# EAGLE board V0 (EAGLE 9.3.0)
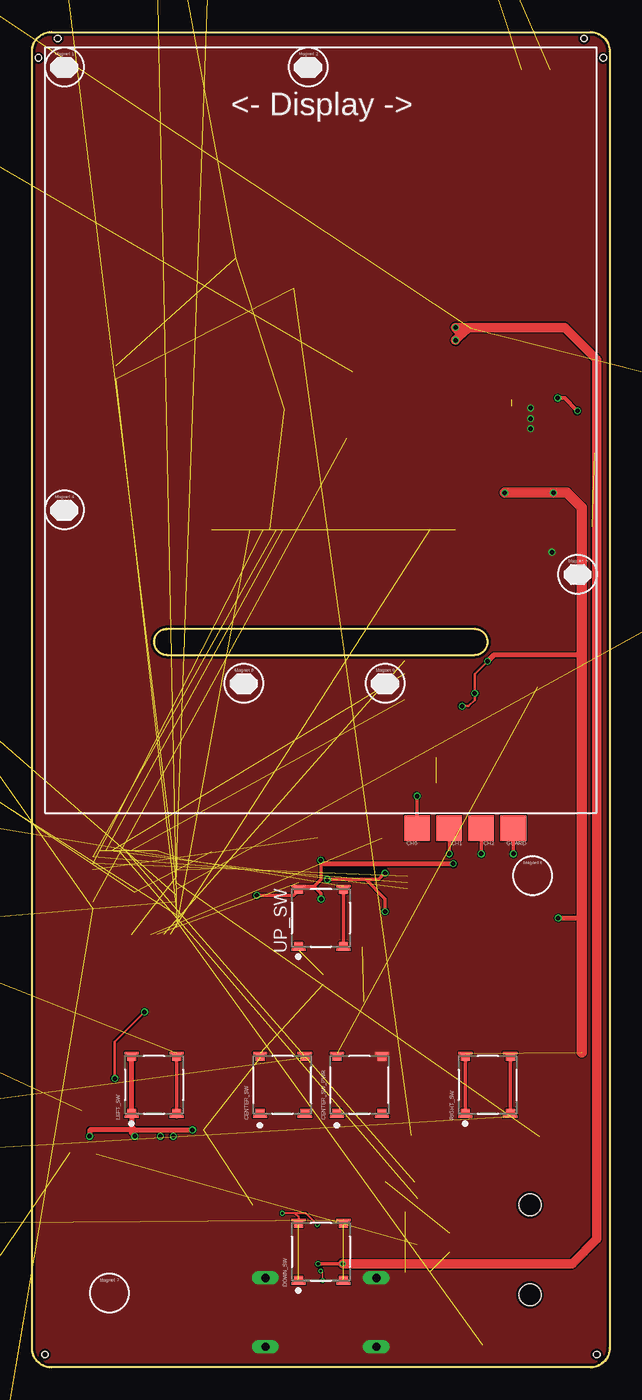
[diagram p10: board, top side]
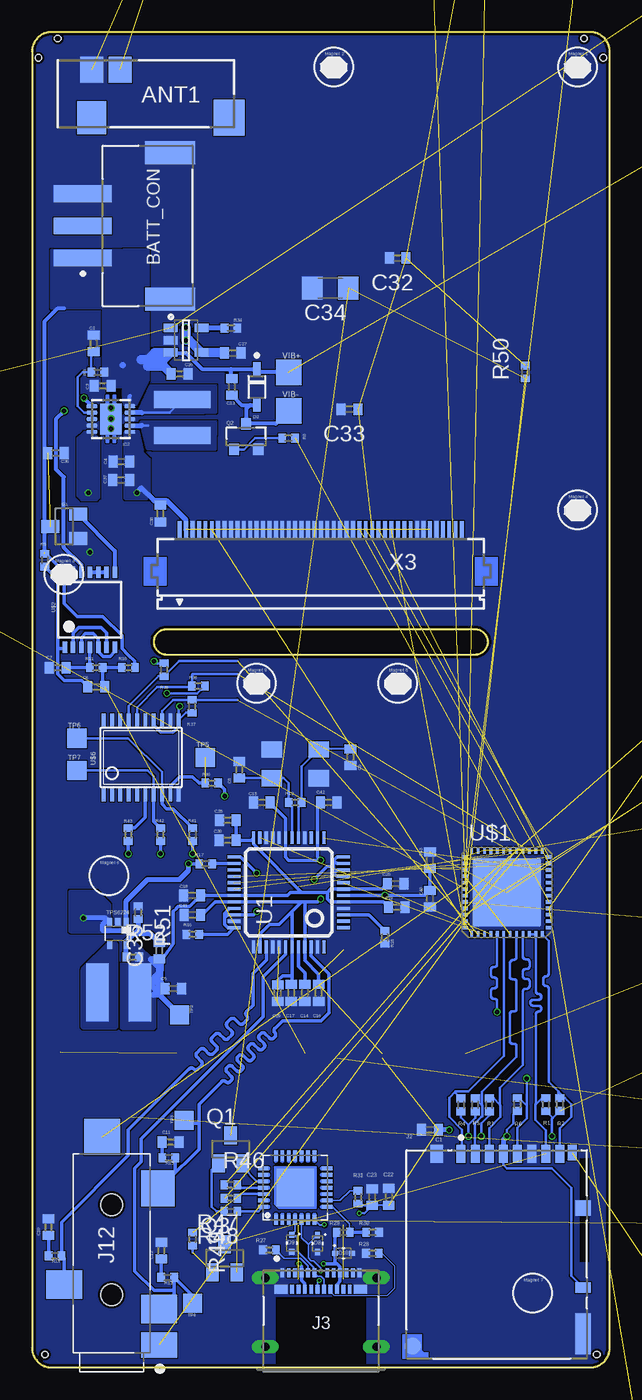
[diagram p11: board, bottom side, seen from below]

Size 45 x 104 mm. Coordinates in mm from the lower left corner, seen from the top.
Outline: 43.5,104 arc-90 45,102.5 45,1.5 arc-90 43.5,0 1.5,0 arc-90 0,1.5 0,102.5 arc-90 1.5,104 43.5,104
Outline: 10.5,55.5 34.5,55.5 arc90 35.5,56.5 arc90 34.5,57.5 10.5,57.5 arc90 9.5,56.5 arc90 10.5,55.5
Copper layers (1*16): Top 0.035mm / dielectric 1.5mm / Bottom 0.035mm
Design rules "jlcpcb": minimum track width 3.5mil, minimum drill 0.2mm, track to track 3.5mil, track to pad 3.5mil, pad to pad 6mil, via to via 6mil, smd to smd 6mil, copper to edge 0.2mm, drill to drill 0.2mm, minimum pad ring 3mil, minimum via ring 3mil, stop-mask expansion 4mil, vias tented up to drill 0mil, thermal gap 10mil
Holes 0.5 mm at 44,1 1,1 0.5,102 44.5,102 2,103.5 43,103.5

## Footprints (pad centres in the part's own frame; a part is rotated, then mirrored left to right if it is on the bottom)
PRO-OB-440_1 = smd 2 x 1.8: 1 1.865,-2.65; 2 1.865,-4.85 | smd 2.6 x 2.25: 3 -1.865,-2.65 | smd 2.8 x 2.45: 4 -1.865,-13.35
JST_S3B-XH-SM4-TB_0 = smd 1.3 x 4.5: 1 -2.5,5.05; 2 0,5.05; 3 2.5,5.05 | smd 1.8 x 3.9: 4 -5.7,-1.75; 5 5.7,-1.75
C0402 = smd 0.7 x 0.9: 1 -0.65,0; 2 0.65,0
C/6032-28R = smd 2.55 x 2.5: + 2.525,0; - -2.525,0
C0201 = smd 0.25 x 0.35: 1 -0.25,0; 2 0.25,0
C1206 = smd 1.6 x 1.8: 1 -1.4,0; 2 1.4,0
E-SWITCH_TL3315NF100Q_0 = smd 0.5 x 0.7: 1 -2.125,1.75; 2 2.125,1.75; 3 -2.125,-1.75; 4 2.125,-1.75 | smd 0.2 x 1.1: 1-2 -2.475,1.75; 2-2 2.475,1.75; 3-2 -2.475,-1.75; 4-2 2.475,-1.75
TP20SQ = smd 2 x 2: TP 0,0
BROADCOM_HSMF-C113_0 = smd 0.85 x 0.9: 1 -1.325,-0.25; 4 1.325,-0.25 | smd 0.45 x 0.5: 2 -0.425,-0.6; 3 0.425,-0.6
ON_SEMI_1N914BWS_0 = smd 1.05 x 0.55: 1 -1.4,0; 2 1.4,0
SOD-523 = smd 0.8 x 0.6: A 0,-0.8; K 0,0.8
ON_SEMICONDUCTOR_ESD5Z5.0T1G_0 = smd 0.48 x 0.4: 1 -0.66,0; 2 0.66,0
E-SWITCH_TL3315NF160Q_0 = smd 0.5 x 0.7: 1 -2.125,1.75; 2 2.125,1.75; 3 -2.125,-1.75; 4 2.125,-1.75 | smd 0.2 x 1.1: 1-2 -2.475,1.75; 2-2 2.475,1.75; 3-2 -2.475,-1.75; 4-2 2.475,-1.75
SOT23 = smd 1 x 1.4: 1 -0.95,-1.1; 2 0.95,-1.1; 3 0,1.1
DRC-S-PVSON-N10 = smd 0.28 x 0.85: 1 -1,-1.475; 2 -0.5,-1.475; 3 0,-1.475; 4 0.5,-1.475; 5 1,-1.475; 6 1,1.475; 7 0.5,1.475; 8 0,1.475; 9 -0.5,1.475; 10 -1,1.475 | smd 2.4 x 1.65: TH 0,0
HIROSE_DM3BT-DSF-PEJS_0 = smd 0.7 x 1.4: 1 -2.775,7.825; 2 -1.675,7.825; 3 -0.575,7.825; 4 0.525,7.825; 5 1.625,7.825; 6 2.725,7.825; 7 3.825,7.825; 8 4.925,7.825 | smd 0.7 x 1.2: 9 5.875,7.925 | smd 1.2 x 0.8: 10 6.725,-2.575 | smd 1 x 1.4: 11 -4.675,7.825 | smd 1.2 x 1.2: 12 6.725,3.625 | smd 1.311 x 1.311: 13 -6.553,-7.116 | smd 1.2 x 3.2: 14 6.725,-6.175
MOLEX_105450-0101_0 = drill 0.635 pad 1.067 long: 1 -4.32,3.36; 2 4.32,3.36; 3 -4.32,-2; 4 4.32,-2 | smd 0.3 x 0.7: A1 -3,3.77; A2 -2.5,3.77; A3 -2,3.77; A4 -1.5,3.77; A5 -1,3.77; A6 -0.5,3.77; A7 0.5,3.77; A8 1,3.77; A9 1.5,3.77; A10 2,3.77; A11 2.5,3.77; A12 3,3.77; B2 2.25,2.47; B3 1.75,2.47; B4 1.25,2.47; B5 0.75,2.47; B6 0.25,2.47; B7 -0.25,2.47; B8 -0.75,2.47; B9 -1.25,2.47; B10 -1.75,2.47; B11 -2.25,2.47 | smd 1 x 0.7: B1 3.1,2.47; B12 -3.1,2.47
CUI_SJ-43515TS-SMT = smd 2 x 2.8: 1 -7.15,-3.7 | smd 2.8 x 2.6: 2 5.05,-3.6 | smd 2.2 x 2.8: 3 -2.45,3.7; 4 -4.35,-3.7 | smd 2.8 x 2.8: 5 9.05,0.75 | hole 1.7: -3.25,0; 3.75,0
QFN28 = smd 2.9 x 2.9: P$0 0,0 | smd 0.8 x 0.3: P$1 -2.5,1.5; P$2 -2.5,1; P$3 -2.5,0.5; P$4 -2.5,0; P$5 -2.5,-0.5; P$6 -2.5,-1; P$7 -2.5,-1.5; P$15 2.5,-1.5; P$16 2.5,-1; P$17 2.5,-0.5; P$18 2.5,0; P$19 2.5,0.5; P$20 2.5,1; P$21 2.5,1.5 | smd 0.3 x 0.8: P$8 -1.5,-2.5; P$9 -1,-2.5; P$10 -0.5,-2.5; P$11 0,-2.5; P$12 0.5,-2.5; P$13 1,-2.5; P$14 1.5,-2.5; P$22 1.5,2.5; P$23 1,2.5; P$24 0.5,2.5; P$25 0,2.5; P$26 -0.5,2.5; P$27 -1,2.5; P$31 -1.5,2.5
ON_SEMI_MMBT5551LT1G_0 = smd 0.9 x 0.8: 1 -1,0.95; 2 -1,-0.95; 3 1,0
R0402 = smd 0.6 x 0.7: 1 -0.5,0; 2 0.5,0
TP15SQ = smd 1.5 x 1.5: TP 0,0
TSP62240 = smd 0.4 x 0.7: 1 -0.65,-0.85; 2 0,-0.85; 3 0.65,-0.85; 4 0.65,0.85; 5 -0.65,0.85
LQFP48 = smd 0.25 x 1: 1 -2.75,-4.25; 2 -2.25,-4.25; 3 -1.75,-4.25; 4 -1.25,-4.25; 5 -0.75,-4.25; 6 -0.25,-4.25; 7 0.25,-4.25; 8 0.75,-4.25; 9 1.25,-4.25; 10 1.75,-4.25; 11 2.25,-4.25; 12 2.75,-4.25; 25 2.75,4.25; 26 2.25,4.25; 27 1.75,4.25; 28 1.25,4.25; 29 0.75,4.25; 30 0.25,4.25; 31 -0.25,4.25; 32 -0.75,4.25; 33 -1.25,4.25; 34 -1.75,4.25; 35 -2.25,4.25; 36 -2.75,4.25 | smd 1 x 0.25: 13 4.25,-2.75; 14 4.25,-2.25; 15 4.25,-1.75; 16 4.25,-1.25; 17 4.25,-0.75; 18 4.25,-0.25; 19 4.25,0.25; 20 4.25,0.75; 21 4.25,1.25; 22 4.25,1.75; 23 4.25,2.25; 24 4.25,2.75; 37 -4.25,2.75; 38 -4.25,2.25; 39 -4.25,1.75; 40 -4.25,1.25; 41 -4.25,0.75; 42 -4.25,0.25; 43 -4.25,-0.25; 44 -4.25,-0.75; 45 -4.25,-1.25; 46 -4.25,-1.75; 47 -4.25,-2.25; 48 -4.25,-2.75
MICROCHIP_MCP73831T-2ATI-OT_1 = smd 1.1 x 0.65: 1 -1.2,0.95; 2 -1.2,0; 3 -1.2,-0.95; 4 1.2,-0.95; 5 1.2,0.95
QFN48 = smd 0.55 x 0.3: 1 -3.275,2.75; 2 -3.275,2.25; 3 -3.275,1.75; 4 -3.275,1.25; 5 -3.275,0.75; 6 -3.275,0.25; 7 -3.275,-0.25; 8 -3.275,-0.75; 9 -3.275,-1.25; 10 -3.275,-1.75; 11 -3.275,-2.25; 12 -3.275,-2.75; 25 3.275,-2.75; 26 3.275,-2.25; 27 3.275,-1.75; 28 3.275,-1.25; 29 3.275,-0.75; 30 3.275,-0.25; 31 3.275,0.25; 32 3.275,0.75; 33 3.275,1.25; 34 3.275,1.75; 35 3.275,2.25; 36 3.275,2.75 | smd 0.3 x 0.55: 13 -2.75,-3.275; 14 -2.25,-3.275; 15 -1.75,-3.275; 16 -1.25,-3.275; 17 -0.75,-3.275; 18 -0.25,-3.275; 19 0.25,-3.275; 20 0.75,-3.275; 21 1.25,-3.275; 22 1.75,-3.275; 23 2.25,-3.275; 24 2.75,-3.275; 37 2.75,3.275; 38 2.25,3.275; 39 1.75,3.275; 40 1.25,3.275; 41 0.75,3.275; 42 0.25,3.275; 43 -0.25,3.275; 44 -0.75,3.275; 45 -1.25,3.275; 46 -1.75,3.275; 47 -2.25,3.275; 48 -2.75,3.275 | smd 5.309 x 5.309: EXP 0,0
TSSOP14 = smd 0.35 x 0.9: 1 -1.95,-2.925; 2 -1.3,-2.925; 3 -0.65,-2.925; 4 0,-2.925; 5 0.65,-2.925; 6 1.3,-2.925; 7 1.95,-2.925; 8 1.95,2.925; 9 1.3,2.925; 10 0.65,2.925; 11 0,2.925; 12 -0.65,2.925; 13 -1.3,2.925; 14 -1.95,2.925
INDUCTOR = smd 1.3 x 4.4: P$1 -1.5,0.2; P$2 1.3,0.2
ECSCRYSTAL = smd 1.6 x 1.25: GND -1.83,1.12; GND2 1.84,-1.11; IN/OUT 1.82,1.12; IN/OUT2 -1.83,-1.11
INDUCTOR' = smd 1.75 x 4.5: P$1 -1.4,0.2; P$2 1.9,0.2
TSSOP20 = smd 0.305 x 0.991: 1 -2.925,-2.918; 2 -2.275,-2.918; 3 -1.625,-2.918; 4 -0.975,-2.918; 5 -0.325,-2.918; 6 0.325,-2.918; 7 0.975,-2.918; 8 1.625,-2.918; 9 2.275,-2.918; 10 2.925,-2.918; 11 2.925,2.918; 12 2.275,2.918; 13 1.625,2.918; 14 0.975,2.918; 15 0.325,2.918; 16 -0.325,2.918; 17 -0.975,2.918; 18 -1.625,2.918; 19 -2.275,2.918; 20 -2.925,2.918
FH12-45S-0.5SH = smd 0.3 x 1.3: 1 -13,3.25; 2 -12.5,3.25; 3 -12,3.25; 4 -11.5,3.25; 5 -11,3.25; 6 -10.5,3.25; 7 -10,3.25; 8 -9.5,3.25; 9 -9,3.25; 10 -8.5,3.25; 11 -8,3.25; 12 -7.5,3.25; 13 -7,3.25; 14 -6.5,3.25; 15 -6,3.25; 16 -5.5,3.25; 17 -5,3.25; 18 -4.5,3.25; 19 -4,3.25; 20 -3.5,3.25; 21 -3,3.25; 22 -2.5,3.25; 23 -2,3.25; 24 -1.5,3.25; 25 -1,3.25; 26 -0.5,3.25; 27 0,3.25; 28 0.5,3.25; 29 1,3.25; 30 1.5,3.25; 31 2,3.25; 32 2.5,3.25; 33 3,3.25; 34 3.5,3.25; 35 4,3.25; 36 4.5,3.25; 37 5,3.25; 38 5.5,3.25; 39 6,3.25; 40 6.5,3.25; 41 7,3.25; 42 7.5,3.25; 43 8,3.25; 44 8.5,3.25; 45 9,3.25

## Placement (x,y rotation side)
ANT1  PRO-OB-440  [PRO-OB-440_1]  43,99.2 90 bottom
BATT_CON  JST_S3B-XH-SM4-TBJST_S3B-XH-SM4-TB_0_0  [JST_S3B-XH-SM4-TB_0]  36,88.91 90 bottom
C1  50uF  [C0402]  14,18.5 180 bottom
C2  .1uF  [C0402]  40.2,79.75 90 bottom
C3  10uF  [C0402]  39.5,76.44 180 bottom
C4  10uF  [C0402]  38.04,70.55 180 bottom
C5  10 uF  [C0402]  34,29.5 0 bottom
C6  1uF  [C0402]  40,53 180 bottom
C7  1uF  [C0402]  43,54.5 0 bottom
C8  33pF  [C0402]  28.86,46.54 270 bottom
C9  33pF  [C0402]  20.19,47.53 90 bottom
C10  10nF  [C0402]  43.73,10.92 90 bottom
C11  10nF  [C0402]  34.21,17.54 0 bottom
C12  47nF  [C0402]  34.93,9.09 90 bottom
C13  0.1 uF  [C0402]  29.43,76.36 270 bottom
C14  1uF  [C0402]  23.74,29.17 270 bottom
C15  100nF  [C0402]  27.1,44 180 bottom
C16  100nF  [C0402]  22.68,29.17 270 bottom
C17  100nF  [C0402]  24.8,29.17 270 bottom
C18  100nF  [C0402]  32.53,36.76 180 bottom
C19  100nF  [C0402]  16.58,35.85 0 bottom
C20  100nF  [C0402]  16.68,37.67 0 bottom
C21  0.1uF  [C0402]  -38.5,32 180 top  (outside the outline)
C22  4.7uF  [C0402]  17.2,13.28 90 bottom
C23  0.1uF  [C0402]  18.5,13.27 90 bottom
C24  4.7uF  [C/6032-28R]  -146.5,167 90 top  (outside the outline)
C25  0.1uF  [C/6032-28R]  -138.5,167 90 top  (outside the outline)
C26  4.7uF  [C0402]  33.5,77.39 0 bottom
C27  4.7uF  [C0402]  29.36,79 0 bottom
C28  10uF  [C0402]  29.76,42.61 180 bottom
C29  10uF  [C0402]  25.87,29.16 270 bottom
C30  2.7pF  [C0201]  11.5,158 90 top  (outside the outline)
C31  4.7pF  [C0201]  15.5,158 90 top  (outside the outline)
C32  10uF  [C0402]  16.52,86.4 180 bottom
C33  0.1uF  [C0402]  20.27,74.63 180 bottom
C34  0.1uF  [C1206]  21.76,84.06 180 bottom
C35  33pF  [C0402]  35.09,32.45 90 bottom
C36  100nF  [C0402]  43.15,71.21 0 bottom
C37  10uF  [C0402]  38.06,69.11 180 bottom
C38  0.1uF  [C0402]  35,66.5 270 bottom
C39  100nF  [C0402]  29.77,41.06 180 bottom
C40  100nF  [C0402]  14,36.5 270 bottom
C41  100nF  [C0402]  32.52,35.24 180 bottom
C42  100nF  [C0402]  21.89,44 0 bottom
C43  10uF  [C0402]  14,39.5 90 bottom
CENTER_SW  E-SWITCH_TL3315NF100QE-SWITCH_TL3315NF100Q_0_0  [E-SWITCH_TL3315NF100Q_0]  19.5,22 90 top
CENTER_SW_PWR  E-SWITCH_TL3315NF100QE-SWITCH_TL3315NF100Q_0_0  [E-SWITCH_TL3315NF100Q_0]  25.5,22 90 top
CH0  TPSQTP20SQ  [TP20SQ]  30,42 180 top
CH1  TPSQTP20SQ  [TP20SQ]  32.5,42 180 top
CH2  TPSQTP20SQ  [TP20SQ]  35,42 180 top
D1  BROADCOM_HSMF-C113BROADCOM_HSMF-C113_0_0  [BROADCOM_HSMF-C113_0]  -13,28.5 90 bottom  (outside the outline)
D2  ON_SEMI_1N914BWSON_SEMI_1N914BWS_0_0  [ON_SEMI_1N914BWS_0]  27.49,76.36 270 bottom
D3  [SOD-523]  -37.5,43 180 top  (outside the outline)
D4  [SOD-523]  -37.5,47 180 top  (outside the outline)
D5  [SOD-523]  -37.5,51 180 top  (outside the outline)
D6  [SOD-523]  -37.5,55 180 top  (outside the outline)
D7  [SOD-523]  -37.5,59 180 top  (outside the outline)
D8  ON_SEMICONDUCTOR_ESD5Z5.0T1GON_SEMICONDUCTOR_ESD5Z5.0T1G_0_0  [ON_SEMICONDUCTOR_ESD5Z5.0T1G_0]  22.76,9.65 270 bottom
D9  ON_SEMICONDUCTOR_ESD5Z5.0T1GON_SEMICONDUCTOR_ESD5Z5.0T1G_0_0  [ON_SEMICONDUCTOR_ESD5Z5.0T1G_0]  24.77,9.67 270 bottom
D10  ON_SEMICONDUCTOR_ESD5Z5.0T1GON_SEMICONDUCTOR_ESD5Z5.0T1G_0_0  [ON_SEMICONDUCTOR_ESD5Z5.0T1G_0]  20.74,8.89 0 bottom
DOWN_SW  E-SWITCH_TL3315NF160QE-SWITCH_TL3315NF160Q_0_0  [E-SWITCH_TL3315NF160Q_0]  22.5,9 90 top
G1  APX809S-31SA  [SOT23]  42.5,65.5 90 bottom
GUARD  TPSQTP20SQ  [TP20SQ]  37.5,42 180 top
IC2  TPS6300  [DRC-S-PVSON-N10]  38.86,73.86 90 bottom
J2  HIROSE_DM3BT-DSF-PEJSHIROSE_DM3BT-DSF-PEJS_0_0  [HIROSE_DM3BT-DSF-PEJS_0]  8.8,8.8 0 bottom
J3  MOLEX_105450-0101MOLEX_105450-0101_0_0  [MOLEX_105450-0101_0]  22.5,3.6 0 bottom
J12  3.5mm TRRS Jack  [CUI_SJ-43515TS-SMT]  38.8,8.9 90 bottom
JL  CP2102N-A02-GQFN28  [QFN28]  24.5,14 90 bottom
LEFT_SW  E-SWITCH_TL3315NF160QE-SWITCH_TL3315NF160Q_0_0  [E-SWITCH_TL3315NF160Q_0]  9.5,22 90 top
Q1  [SOT23]  29.53,16.99 0 bottom
Q2  ON_SEMI_MMBT5551LT1GON_SEMI_MMBT5551LT1G_0_0  [ON_SEMI_MMBT5551LT1G_0]  28.32,72.5 90 bottom
Q3  [SOT23]  30,8.5 0 bottom
R1  10k  [R0402]  4.98,20.47 270 bottom
R2  10k  [R0402]  3.88,20.48 270 bottom
R3  100  [R0402]  39.88,77.5 0 bottom
R4  10k  [R0402]  11.57,20.45 270 bottom
R5  10k  [R0402]  10.47,20.45 270 bottom
R6  10k  [R0402]  7.19,20.48 270 bottom
R7  10k  [R0402]  9.38,20.45 270 bottom
R8  1.5K  [R0402]  25.01,72.38 180 bottom
R9  100k  [R0402]  44,62.87 90 bottom
R10  100k  [R0402]  37.5,54.5 0 bottom
R11  10M  [R0402]  40,54.5 180 bottom
R12  1M  [R0402]  24.5,44 0 bottom
R13  10  [R0402]  34.44,7 180 bottom
R14  20  [R0402]  43.21,8.7 180 bottom
R15  20  [R0402]  34.35,16.33 180 bottom
R16  100K  [R0402]  32.49,33.74 0 bottom
R17  100k  [R0402]  31.47,39.23 180 bottom
R18  100k  [R0402]  17.5,33.5 90 bottom
R19  155k  [R0402]  -38.5,-4 180 top  (outside the outline)
R20  75k  [R0402]  -38.5,1 180 top  (outside the outline)
R21  35k  [R0402]  -46.5,14.5 180 bottom  (outside the outline)
R22  15k  [R0402]  -38.5,11 180 top  (outside the outline)
R23  5k  [R0402]  -38.5,16 180 top  (outside the outline)
R24  50k  [R0402]  -38.5,28 180 top  (outside the outline)
R25  5k  [R0402]  -22.5,57 180 top  (outside the outline)
R26  10k  [R0402]  -38.5,23 180 top  (outside the outline)
R27  5.1k  [R0402]  26.51,9.14 180 bottom
R28  5.1k  [R0402]  18.49,8.88 180 bottom
R29  22.1k  [R0402]  20.76,10.51 180 bottom
R30  47.5k  [R0402]  18.47,10.53 180 bottom
R31  1k  [R0402]  19.59,13.25 270 bottom
R32  10k  [R0402]  -130,159.5 90 top  (outside the outline)
R33  5k  [R0402]  -126.5,165 90 top  (outside the outline)
R34  2k  [R0402]  29.5,80.94 0 bottom
R35  100  [R0402]  -93.5,165 90 top  (outside the outline)
R36  50  [R0402]  -86.5,165 90 top  (outside the outline)
R37  4.7k  [R0402]  32.53,51.49 270 bottom
R38  4.7k  [R0402]  32.05,53.08 0 bottom
R39  4.7k  [R0402]  34.72,54.34 90 bottom
R40  10k  [R0402]  31,45.5 0 bottom
R41  10k  [R0402]  32.5,41.5 270 bottom
R42  10k  [R0402]  35,41.5 270 bottom
R43  10k  [R0402]  37.5,41.5 270 bottom
R44  10K  [R0402]  9.5,120 90 top  (outside the outline)
R45  50k  [R0402]  -3.5,159 90 top  (outside the outline)
R46  1k  [R0402]  29.51,14.22 0 bottom
R47  1k  [R0402]  29.51,13.18 180 bottom
R48  10k  [R0402]  29.51,12.14 180 bottom
R49  10k  [R0402]  32.5,10 270 bottom
R50  10k  [R0402]  6.57,77.52 90 bottom
R51  180k  [R0402]  36.73,35.43 270 bottom
R52  360k  [R0402]  37.16,31.96 0 bottom
R53  10k  [R0402]  71.5,71 90 top  (outside the outline)
R54  315k  [R0402]  -24.5,-23 0 top  (outside the outline)
R55  25  [R0402]  -3,-7 0 top  (outside the outline)
RIGHT_SW  E-SWITCH_TL3315NF160QE-SWITCH_TL3315NF160Q_0_0  [E-SWITCH_TL3315NF160Q_0]  35.5,22 90 top
TP1  TPSQTP15SQ  [TP15SQ]  25.5,158 90 top  (outside the outline)
TP2  TPSQTP15SQ  [TP15SQ]  33.5,27.45 270 bottom
TP3  TPSQTP15SQ  [TP15SQ]  33.16,19.24 90 bottom
TP4  TPSQTP15SQ  [TP15SQ]  32.5,5 180 bottom
TP5  TPSQTP15SQ  [TP15SQ]  31.5,47.5 0 bottom
TP6  TPSQTP15SQ  [TP15SQ]  41.5,49 0 bottom
TP7  TPSQTP15SQ  [TP15SQ]  41.5,46.5 0 bottom
TPS6224  TPS62240  [TSP62240]  38.31,33.81 180 bottom
U1  VS1053-L  [LQFP48]  25,37 90 bottom
U2  MICROCHIP_MCP73831T-2ATI-OTMICROCHIP_MCP73831T-2ATI-OT_0_1  [MICROCHIP_MCP73831T-2ATI-OT_1]  33,80 0 bottom
U$1  ESP32-PICO-D4  [QFN48]  8,37 0 bottom
U$2  TOSHIBA-NAND-GATE  [TSSOP14]  40.5,59 0 bottom
U$3  2.2uH  [INDUCTOR]  33.49,73.87 270 bottom
U$4  ECS12P88MHZ  [ECSCRYSTAL]  24.5,47 0 bottom
U$5  CR43NP-2R2MC  [INDUCTOR']  38.5,29 0 bottom
U$6  COMMS-AT42QT2120XU  [TSSOP20]  36.5,47.5 0 bottom
U$7  1.6nH  [R0402]  19.5,158 90 top  (outside the outline)
UP_SW  E-SWITCH_TL3315NF160QE-SWITCH_TL3315NF160Q_0_0  [E-SWITCH_TL3315NF160Q_0]  22.5,35 90 top
VIB+  TPSQTP20SQ  [TP20SQ]  25,77.5 0 bottom
VIB-  TPSQTP20SQ  [TP20SQ]  25,74.5 0 bottom
X3  FH12-45S-0.5SH  [FH12-45S-0.5SH]  20.5,62 0 bottom

## Tracks (layer width: path | path; a pad name or v marks a point on that pad's centre or on a via)
ATQ_CHANGE  (1 unrouted)
  Bottom 0.2: U$6.17 37.48,51.5 35.14,53.84 R39.1 33.56,55 29,55
BLUE_GREEN_LED_CATH  (2 unrouted)
BUTTON_ADC  (7 unrouted)
BUTTON_DIN  (2 unrouted)
CARD_DETECT  (1 unrouted)
CENTER_SW_PWR_TOP  (1 unrouted)
  Bottom 0.254: R10.1 R11.1 39.5,53.15 C6.1
CHARGE_DETECT  (1 unrouted)
CP_RSTB
  Bottom 0.127: JL.P$9 21,13 20.25,13.75 R31.1
DISPLAY_CS  (1 unrouted)
DISPLAY_RST  (1 unrouted)
DREQ  (1 unrouted)
DTR  (1 unrouted)
  Bottom 0.2: JL.P$31 27.36,12.14 R48.1 29.05,12.1
EN  (3 unrouted)
GND  (via drill 0.35)  (10 unrouted)
  other vias: 38.84,74.72 38.84,73.89 38.85,73.11 40.5,63.5
  pour Top (rank 2, no thermals): 1.5,0 arc-90 0,1.5 0,102.5 arc-90 1.5,104 43.5,104 arc-90 45,102.5 45,1.5 arc-90 43.5,0
  cutout Top (no thermals): 10.5,57.5 arc90 9.5,56.5 arc90 10.5,55.5 34.5,55.5 arc90 35.5,56.5 arc90 34.5,57.5
  cutout Bottom (no thermals): 10.5,57.5 arc90 9.5,56.5 arc90 10.5,55.5 34.5,55.5 arc90 35.5,56.5 arc90 34.5,57.5
  pour Bottom (rank 2, no thermals): 1.5,0 arc-90 0,1.5 0,102.5 arc-90 1.5,104 43.5,104 arc-90 45,102.5 45,1.5 arc-90 43.5,0
I2C_SCL  (1 unrouted)
  Bottom 0.2: U$6.16 36.83,51.41 35.24,53 32.63,53 R38.1 32.55,53.95 32.5,54 29,54
I2C_SDA  (1 unrouted)
  Bottom 0.2: U$6.13 34.88,51.12 34,52 33.99,51.99 R37.1 29,52
IO2  (1 unrouted)
  Bottom 0.2: J2.7 4.98,18.48 5.78,19.28 5.78,20.47 5.75,20.5 | R1.1 5.28,20.97 5.75,20.5 | 5.75,20.5 5.75,27.5 arc90 5.54,27.71 arc-90 5.33,27.92 5.33,27.96 arc-90 5.54,28.17 5.96,28.17 arc90 6.17,28.38 6.17,28.42 arc90 5.96,28.63 5.54,28.63 arc-90 5.33,28.84 5.33,28.88 arc-90 5.54,29.09 arc90 5.75,29.3 U$1.23 U$1.22
IO4
  Bottom 0.2: J2.8 3.88,18.62 3,19.5 3,20.5 3.5,21 | 3.5,21 3.86,21 R2.1 4,21.1 4,21.5 | U$1.24 4.75,33.23 4.75,30.66 arc90 4.96,30.45 arc-90 5.17,30.24 5.17,29.92 arc-90 4.96,29.71 arc90 4.75,29.5 4.75,22.25 4,21.5 | 3.5,21 4,21.5
IO12
  Bottom 0.2: J2.1 11.5,16.7 11.5,18.5 12.5,19.5 12.5,21 12,21.5 | U$1.18 8.25,24.27 11.02,21.5 12,21.5 | R4.1 12,21.38 12,21.5
IO13
  Bottom 0.2: J2.2 10.5,16.65 10.5,19 10,19.5 9.93,19.57 9.93,20.41 9.94,20.42 | 9.94,20.42 R5.1 | U$1.20 7.25,31.96 arc90 7.46,31.75 arc-90 7.78,31.43 7.78,30.45 arc-90 7.57,30.24 7.46,30.24 arc90 7.25,30.03 7.25,27.94 arc90 7.46,27.72 7.57,27.72 arc-90 7.78,27.51 7.78,25.42 arc-90 7.57,25.21 7.46,25.21 arc90 7.25,25 7.25,24.17 9.94,21.48 9.94,20.42
IO14  (via drill 0.35)
  Top 0.2: v6.44,22.5 v6.45,22.51 6.45,25.36 v8.77,27.68
  Bottom 0.2: J2.5 7.18,18.66 6.44,19.39 6.44,20.36 | 8.77,33.71 8.77,31.39 arc90 8.98,31.18 9.03,31.18 arc-90 9.24,30.97 9.24,30.57 arc-90 9.03,30.36 8.98,30.36 arc90 8.77,30.15 8.77,29.75 arc90 8.98,29.53 9.03,29.53 arc-90 9.24,29.32 9.24,28.92 arc-90 9.03,28.71 8.98,28.71 arc90 8.77,28.5 v8.77,27.68 | R6.1 7.06,20.98 6.44,20.36 | v6.44,22.5 6.45,22.49 | 6.44,20.36 v6.44,22.5 | v6.44,22.5 v6.45,22.51
  Bottom 0.254: 8.77,33.71 U$1.17
IO15
  Bottom 0.2: J2.3 9.38,18.62 8.5,19.5 8.5,20.42 8.54,20.46 | R7.1 9.03,20.95 8.54,20.46 | U$1.21 6.75,32 arc-90 6.54,31.79 6.45,31.79 arc90 6.23,31.58 6.23,31.23 arc90 6.45,31.02 6.54,31.02 arc-90 6.75,30.81 6.75,30.47 arc-90 6.54,30.26 6.45,30.26 arc90 6.23,30.05 6.23,29.7 arc90 6.45,29.49 6.54,29.49 arc-90 6.75,29.28 6.75,23.58 8.54,21.79 8.54,20.46
N$1
  Bottom 0.305: C13.2 28.68,74.96 28,74.96 | 28,74.96 D2.2 | 28,74.96 28.32,74.64 Q2.3 26,73.5 VIB-.TP
N$2  (1 unrouted)
N$3
  Bottom 0.2: C2.1 40.38,79.03 R3.1 41.07,77.52 41.45,77.14 41.45,74.86 40.95,74.36 IC2.7
  Bottom 0.254: IC2.7 IC2.8
N$4
  Bottom 0.2: U$4.IN/OUT2 26.5,45.72 | U$4.IN/OUT2 C8.2 | U$4.IN/OUT2 25.39,45.89 25,45.5 R12.1 24.75,43.75 U1.18
N$5
  Bottom 0.254: R9.1 43,61.37 43,56 | C6.2 41.15,53.5 42.5,53.5 43,54 43,56 | U$2.1 42.52,56 43,56
N$6
  Bottom 0.2: 36.45,73.36 35.95,73.36
  Bottom 0.406: 33.29,72.63 U$3.P$2 | IC2.2 36.45,73.36
  pour Bottom (no thermals): 36.51,73.61 36.5,73.62 30.72,73.66 30.73,71.54 35.58,71.52 36,71.55
N$8
  Bottom 0.2: U$3.P$1 34.3,74.36 36.45,74.36
  Bottom 0.406: 36.45,74.36 IC2.4
  pour Bottom (no thermals): 30.71,74.41 30.7,76.45 35.42,76.42 35.75,76.44 36.58,74.65 36.59,74.38 31.63,74.38
N$10
  pour Bottom (no thermals): 38.5,33 38.5,26.5 41,26.5 41,31 39,33
N$11  (1 unrouted)
  Bottom 0.254: R40.1 32,45.5 32.5,46 33.5,46 34.23,45.27 U$6.9
N$12
  Bottom 0.254: U$2.7 38.55,55.76 38.92,55.38 39.48,55.38 39.85,55.76 U$2.5 | U$2.3 41.15,56.86 40.87,57.14 40.23,57.14 39.84,56.75 39.84,56.74 39.84,56.09
  Bottom 0.305: 39.84,56.09 U$2.5
N$14
  Bottom 0.254: U$2.4 R11.2 C7.2
N$16  (2 unrouted)
  Top 0.254: UP_SW.3 UP_SW.4
N$18  (via drill 0.35)
  Top 0.254: CH1.TP v32.5,40
  Bottom 0.254: v32.5,40 R41.2
N$19
  Bottom 0.254: U$2.6 39.2,57.2 39.62,57.62 41.36,57.62 41.8,57.18 U$2.2
N$20  (via drill 0.35)
  Top 0.254: CH2.TP v35,40
  Bottom 0.254: v35,40 R42.2
N$21
  Bottom 0.2: C9.2 22.61,48.19 U$4.IN/OUT 24,46.8 R12.2 24.25,43.75 U1.17
N$22
  Bottom 0.2: R8.2 27.61,72.39 28.5,71.5 Q2.1
N$23
  Bottom 0.2: U$6.8 34.88,46.38 37.5,49 TP6.TP
  Bottom 0.254: R41.1 34,43.5 34.5,43.5 34.88,43.88 U$6.8
N$24  (2 unrouted)
  Top 0.254: RIGHT_SW.4 RIGHT_SW.3
N$25
  Bottom 0.2: U$6.7 35.52,46.02 36,46.5 TP7.TP
  Bottom 0.254: R42.1 35.52,42.52 U$6.7
N$26
  Bottom 0.254: R43.1 37,42 36.17,42.83 U$6.6
N$27
  Bottom 0.254: U1.26 30.95,39.25 R17.1
N$28  (3 unrouted)
N$29  (2 unrouted)
N$30  (2 unrouted)
N$31  (2 unrouted)
N$32  (6 unrouted)
N$33
  Bottom 0.305: U$2.9 U$2.10 U$2.11
N$34
  Bottom 0.254: R13.2 C12.1
N$35
  Bottom 0.254: R14.2 43.71,10.25 C10.1
N$36
  Bottom 0.254: C11.1 R15.2
N$37  (via drill 0.35)
  Top 0.254: CH0.TP v30,44.5
  Bottom 0.254: v30,44.5 30,45 R40.2
N$38  (via drill 0.35)
  Top 0.254: v23.02,38 26,38 | 26,38 27.5,36.5 v27.5,35.5 | 26,38 27,38 v27.5,38.5
  Bottom 0.254: R16.2 29.76,33.74 U1.36 29.75,34.25 30,34.5 30,35 | U1.33 29.62,35.75 30,35.37 30,35 | 30,35 29.75,35.25 U1.34 27.75,35.25 v27.5,35.5 | U1.12 21.25,39.75 21.5,39.5 | 21.5,38.5 21.25,38.25 U1.9 | 21.5,39.5 21.5,39 | 21.5,39 21.5,38.5 | U1.10 21.25,38.75 21.5,38.5 | U1.11 21.25,39.25 21.5,39.5 | 21.5,39 22.02,39 v23.02,38 | v27.5,38.5 28.75,39.75 U1.25
N$39
  Bottom 0.254: C14.1 23.74,30.74 24.25,31.25 U1.44
N$40  (via drill 0.35)
  Top 0.254: GUARD.TP v37.5,40
  Bottom 0.254: v37.5,40 R43.2
N$41
  Bottom 0.254: U1.3 18.75,35.25 R18.2
N$42
  Bottom 0.406: R52.1 TPS6224.5 37.66,33.17 37.07,33.76 37,33.76 | C35.2 35.75,33.76 37,33.76 | R51.2 36.73,34.03 37,33.76
N$43
  Bottom 0.305: G1.2 38.55,63.6 U$2.8
N$46  (2 unrouted)
  Top 0.254: LEFT_SW.4 LEFT_SW.3-2
N$48
  Bottom 0.254: J12.4 33.94,5.71 33.94,6 | 33.94,6 R13.1 32.5,5.56 TP4.TP | 33.94,6 35.5,6 37,7.5 37,15.5 36.5,16 36.5,17.79 27,27.29 27,30.4 25.25,32.15 U1.42
N$49
  Bottom 0.254: J12.3 42.5,8.49 R14.1 42.71,11.29 37.5,16.5 37.5,18.5 32.75,23.25 arc90 32.41,23.25 arc-90 32.08,23.25 31.82,23.5 arc-90 31.82,23.84 32.16,24.18 arc90 32.16,24.51 31.91,24.77 arc90 31.57,24.77 31.23,24.43 arc-90 30.89,24.43 30.64,24.69 arc-90 30.64,25.02 30.98,25.36 arc90 30.98,25.7 30.72,25.95 arc90 30.39,25.95 30.05,25.61 arc-90 29.71,25.61 29.46,25.87 arc-90 29.46,26.2 29.8,26.54 arc90 29.8,26.88 29.54,27.13 arc90 29.21,27.13 28.87,26.79 arc-90 28.53,26.79 28.28,27.05 arc-90 28.28,27.38 arc90 28.28,27.72 27.8,28.2 27.8,30.7 26.75,31.75 U1.39
N$50
  Bottom 0.102: J3.A5 23.5,7.9 24.08,8.48 25.35,8.48 R27.1
N$51
  Bottom 0.09: R28.1 17.72,8.88 16.77,7.93 16.77,6.17 17.35,5.59 21.45,5.59 21.75,5.88 J3.B5
N$52
  Bottom 0.127: R29.1 20.26,11.17 21.55,12.45 21.59,12.5 JL.P$8
  Bottom 0.254: R29.1 18.99,10.51 R30.2
N$54
  Bottom 0.406: R34.1 U2.5
N$55  (1 unrouted)
N$56  (1 unrouted)
N$57
  Bottom 0.254: R15.1 33.85,15.3 34.58,14.58 | J12.2 34.58,14.58 | U1.46 23.25,32.03 21.87,30.65 21.87,27.63 22.5,27 25.5,27 26.09,26.41 arc-90 26.09,26.08 arc90 26.09,25.74 26.17,25.65 arc90 26.51,25.65 26.85,25.99 arc-90 27.18,25.99 27.27,25.9 arc-90 27.27,25.56 26.93,25.23 arc90 26.93,24.89 27.02,24.8 arc90 27.36,24.8 27.7,25.14 arc-90 28.03,25.14 28.12,25.05 arc-90 28.12,24.71 27.79,24.38 arc90 27.79,24.04 27.88,23.95 arc90 28.21,23.95 28.55,24.29 arc-90 28.88,24.29 28.97,24.2 arc-90 28.97,23.86 28.64,23.53 arc90 28.64,23.19 28.73,23.1 arc90 29.06,23.1 29.4,23.44 arc-90 29.74,23.44 29.82,23.35 arc-90 29.82,23.01 29.49,22.67 arc90 29.49,22.34 29.58,22.25 arc90 29.91,22.25 arc-90 30.25,22.25 32,20.5 32,19 | 32,19 32,17 34.42,14.58 34.58,14.58 | 33.16,19.34 TP3.TP 32.92,19 32,19
N$58
  Bottom 0.2: R48.2 30.64,12.14 31,12.5 31,15.37 Q1.1
N$59  (1 unrouted)
  Bottom 0.2: 32.5,8.95 R49.2
RED_LED_CATH  (2 unrouted)
RTS  (1 unrouted)
  Bottom 0.2: JL.P$24 27.5,14.5 28.58,15.58 Q1.2
RXD
  Bottom 0.2: JL.P$25 28.79,14 R46.2
RXD0  (1 unrouted)
SPI_CLK  (2 unrouted)
SPI_MISO  (2 unrouted)
SPI_MOSI  (2 unrouted)
SYS_ENABLE  (via drill 0.35)
  Top 0.305: v42.5,74.5 41.5,75.5 v40.96,75.5
  Bottom 0.305: v40.96,75.5 40.96,75.49 IC2.6 | U$2.12 41.15,62.5 42.52,63.87 42.52,69.36 43.14,69.98 43.14,73.84 42.5,74.48 v42.5,74.5
TRRS_INLINE_CTRL  (2 unrouted)
TRRS_TIP_SW  (2 unrouted)
TXD
  Bottom 0.2: R47.1 28.69,13.5 JL.P$26
TXD0  (1 unrouted)
  Bottom 0.2: R46.1 29.79,14.44
USB_D+
  Bottom 0.102: J3.B6 22.25,6.88 22.48,7.11 22.74,7.11 J3.A6 23.02,7.39 23.02,7.76 24.28,9.02 24.28,10.03 24.58,10.33 D9.1 24.5,10.6 JL.P$4
USB_D-  (via drill 0.2)
  Top 0.102: v22.49,7.52 22.63,7.38 v22.63,6.76
  Bottom 0.102: J3.A7 22.15,7.52 v22.49,7.52 22.49,7.73 23.08,8.31 23.26,8.31 23.48,8.53 23.48,9.59 | v22.63,6.76 22.75,6.64 J3.B7 | 23.48,9.59 D8.1 | 23.48,9.59 24,10.11 JL.P$5
V1P8
  Bottom 0.254: C18.1 U1.31 25.1,36.75 24.85,37 24,37 | C18.1 | C19.1 17.63,36.25 U1.5 21.75,36.25 22,36.5 22,37 | C20.1 17.75,37.25 U1.7 21.75,37.25 22,37 | 22,37 24,37 | 24,37 27.75,40.75 U1.24 27.94,41.06 C39.1 C28.1 | C18.1 32.71,35.91 33.61,35.91 33.74,35.78 33.74,35.76 34,35.5 34,33 34.94,31.65
  Bottom 0.406: 34.94,30.94 34.94,31.65 C35.1 35.8,31.8 35.2,31.2 35.2,30.7 35.52,30.37 | 35.52,30.35 35.52,30.34 | 35.52,30.35 35.52,30.37 | 34.94,30.94 35.19,30.69 | 35.19,30.69 35.5,30.37 | 35.5,30.37 35.52,30.35 | 34.94,30 34.94,29.78 34.83,29.67 | 34.94,30 34.94,30.94 | C5.1 34.83,29.67 | C5.1 35,29.5 | 35,29.5 35.22,29.5 | 35.22,29.5 35.5,29.5 36,30 35.5,30 | 35.19,30.69 35,30.5 35,30.31 | 35,30.31 35,30 | 35,30 35,29.5 | 35.5,30 35.33,30 | 35.33,30 35,30 | 35.5,30 35.5,30.37 | 34.94,30 35,30 | 35.52,30.37 35.46,30.31 35,30.31 | 34.83,29.67 35.01,29.67 35.33,30 | C5.1 35.16,28.99 35.6,28.99 35.22,29.37 35.22,29.5 | TP2.TP 35,28.95 35,29.5
  pour Bottom (no thermals): 37,33 38,33 38,26.5 35.5,26.5 35.5,31.5
V3P3  (via drill 0.2, 0.35)  (29 unrouted)
  Top 0.152: v22.22,11.11 21.33,12 20.5,12 | 20.5,12 v19.5,12 | 20.5,12 20.75,11.75 DOWN_SW.2
  Top 0.2: v35.5,55 34.5,54 v34.5,52.5 34.5,52 34,51.5 v33.5,51.5 | 10,18.5 v10,18 | 11,18.5 v11,18
  Top 0.254: 21.98,37.48 UP_SW.2-2 UP_SW.2 20.38,36.75 17.52,36.75 v17.5,36.77 | 21.98,37.48 22.5,38 v22.5,39.5 22.77,39.23 | 21.98,37.48 22.52,36.93 v22.52,36.48 | RIGHT_SW.2 RIGHT_SW.1
  Top 0.406: v32.81,39.23 22.77,39.23 | LEFT_SW.2 LEFT_SW.1 7.75,18.75 | v41,35 42.82,35 | v35.5,55 36,55.5 42.82,55.5 | 7.75,18.75 8,18.5 | 8,18.5 10,18.5 11,18.5 v12.5,18.5 | 8,18.5 4.5,18.5 4.5,18.01 v4.48,18 | 7.75,18.75 7.75,18.25 v8,18
  Top 0.813: v36.83,68.12 v40.62,68.12 41.67,68.12 42.82,66.97 42.82,55.5 42.82,35 42.82,24.54 42.83,24.53
  Bottom 0.152: JL.P$6 JL.P$7 22.61,11.11 v22.22,11.11 | C22.1 C23.1 19.12,12 v19.5,12
  Bottom 0.2: R38.2 32.13,52.5 v34.5,52.5 | R39.2 35.34,54.84 v35.5,55 | v33.5,51.5 33.58,51.42 U$6.11 33,50.99 R37.2 | C23.1 19.46,12.62 R31.2 | v4.48,18 4.48,19.37 4.43,19.43 | 4.43,19.43 R2.2 | 4.43,19.43 4.44,19.43 R1.2 | v8,18 8,18.5 7.5,19 7.5,19.67 R6.2 | v10,18 10,19 9.38,19.62 R7.2 | 11,18.91 11,18.5 v11,18 | R5.2 10.47,19.44 11,18.91 | 11,18.91 11.57,19.48 R4.2 | J2.4 8.28,15.77 8,15.5 4.5,15.5 3,14 3,7.15 J2.10
  Bottom 0.254: v22.52,36.48 22.75,36.25 23.75,36.25 | 24,36.25 U1.32 30.75,36.25 31.76,35.24 C41.1 | 24,36.25 24.75,35.5 | 24.75,35.5 U1.43 24.75,30.5 | 24,36.25 23.75,36.25 | 23.75,36.25 U1.45 23.75,31.68 22.68,30.61 C16.1 | 24.75,35.5 25.75,34.5 26.5,34.5 27.25,33.75 U1.38 | 24.75,30.5 24.75,29.87 C17.1 | C15.1 26.45,43.95 25.25,42.75 U1.19 25.25,39.75 25,39.5 v22.5,39.5 22.75,39.75 U1.14 22.75,43.79 C42.1 | 24.75,30.5 25.5,30.5 25.87,30.13 C29.1 | C43.1 C40.1 14.4,36.75 17.49,36.75 v17.5,36.77 17.52,36.75 U1.6 | R17.2 v32.81,39.23 | U$6.11 33.58,49.92 34,49.5 35,49.5 35.52,50.02 U$6.14
  Bottom 0.406: X3.2 33,66 34.5,67.5 35,67.5 | C38.1 35,67.5 | 35,67.5 35.5,67.5 36.5,68.5 36.83,68.17 v36.83,68.12 | TPS6224.3 39.15,34.85 | 39.15,34.85 39.3,35 v41,35 | 39.15,34.85 39.5,34.5 39.5,34 38,34 37.66,34.34 TPS6224.1 37.66,36.34 36,38 33.5,38 32.81,38.69 v32.81,39.23 | v8,18 8.28,17.73 J2.4 | v12.5,18.5 C1.1
  pour Bottom (no thermals): 36.7,72.89 36.38,71.49 36.38,71.29 35.84,70.75 35.84,67.89 36.09,67.64 37.7,67.64 37.78,67.72 37.78,72.81 37.67,72.92 36.72,72.92 36.95,72.86
  pour Bottom (no thermals): 40.95,72.86 41.45,72.36 41.45,67.86 41.14,67.55 39.96,67.55 39.76,67.75 39.76,72.33 40.29,72.86
  pour Bottom (no thermals): 39,35 39,36 40,37 41,37 42,37 42,34.5 42,34 39,34
VBAT  (4 unrouted)
  Bottom 0.254: 44,63.48 U$2.14 42.5,61.88 42.5,59.5 41.5,58.5 39.5,58.5 38,57 38,56 37.5,55.5 37,55 R10.2
  Bottom 0.305: 37.38,75.36 37.38,75.68 | U2.3 34.15,79 33,79 31.76,77.76 29.5,77.76 | 29.5,77.76 D2.1 27.23,77.5 VIB+.TP | C13.1 29.5,77.08 29.5,77.76 | 42.5,82.5 43,82.5 44,81.5 44,65.5 | 44,63.48 44,65.5 | G1.3 44,65.5
  Bottom 0.508: 37.93,78.05 37.94,78.05
  Bottom 0.75: 36.5,78.5 34.75,78.5 U2.3 35.45,79.05 36,78.5 | C26.1 34.76,78 36,78
  pour Bottom (no thermals): 35.95,87 35.95,76.89 36,76.89 36.88,75.01 37.85,75.01 37.85,87
  pour Bottom (no thermals): 37.95,76.36 39.45,76.36 39.45,82.5 43.5,82.5 43.5,87 36.45,87 36.45,76.86
VBAT_ADC_IN  (2 unrouted)
VBUS  (via drill 0.25, 0.35)
  Top 0.2: 24.2,8.06 v24.21,8.07
  Top 0.254: v22.29,8.06 24.2,8.06
  Top 0.75: v24.21,8.07 42.07,8.07 44,10 44,78.5 41.5,81 34,81 | 34,81 33.5,80.5 | 33.5,80.5 v33,80 | 33.5,80.5 v33,81 34,81
  Bottom 0.102: 23.75,5.87 J3.B9
  Bottom 0.15: J3.B9 23.76,6.06 23.76,5.85
  Bottom 0.2: J3.B9 | 21.5,8.06 21.4,8.16
  Bottom 0.254: J3.B4 21.25,6.45 21,6.7 J3.A9 21,7.83 21.23,8.06 21.5,8.06 v22.29,8.06 | J3.B9 23.76,6.56 24,6.8 J3.A4 24,7.86 v24.21,8.07 | 21.4,8.16 D10.1 21.4,10.37 R29.2
  Bottom 0.305: C27.1 30.23,79.05
  Bottom 0.75: v33,81 v33,80 32.75,80 U2.4 30.23,79.05
VIB_MOTOR  (1 unrouted)
VS_CMD_CS  (1 unrouted)
VS_DATA_CS  (1 unrouted)

## Text on the board
tPlace: Magnet 1 | Magnet 2 | <- Display -> | Magnet 4 | Magnet 3 | Magnet 8 | Magnet 9 | Magnet 6 | Magnet 7
bPlace: Magnet 1 | Magnet 2 | Magnet 4 | Magnet 3 | Magnet 8 | Magnet 9 | Magnet 6 | Magnet 7
Document: 2mm should be enough to account for the 0.5mm tolerance, the bend, and going through the hole